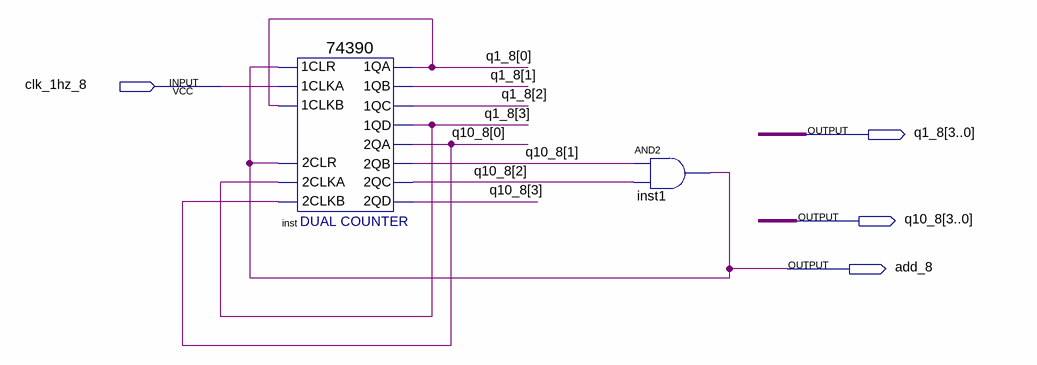
[diagram p0: schematic sheet]
// Quartus schematic m60_8.bdf as structural Verilog: 2 symbols, 4 pins
module m60_8 (
  input  clk_1hz_8,
  output [3:0] q1_8,
  output [3:0] q10_8,
  output add_8
);

  \74390  inst (
    .\2CLKA (q1_8[3]), .\2CLR (add_8), .\2CLKB (q10_8[0]), .\1CLR (add_8), .\1CLKA (clk_1hz_8),
    .\1CLKB (q1_8[0]), .\1QA (q1_8[0]), .\1QB (q1_8[1]), .\1QC (q1_8[2]), .\1QD (q1_8[3]), .\2QA (q10_8[0]),
    .\2QB (q10_8[1]), .\2QC (q10_8[2]), .\2QD (q10_8[3]));
  and inst1 (add_8, q10_8[1], q10_8[2]);
endmodule
